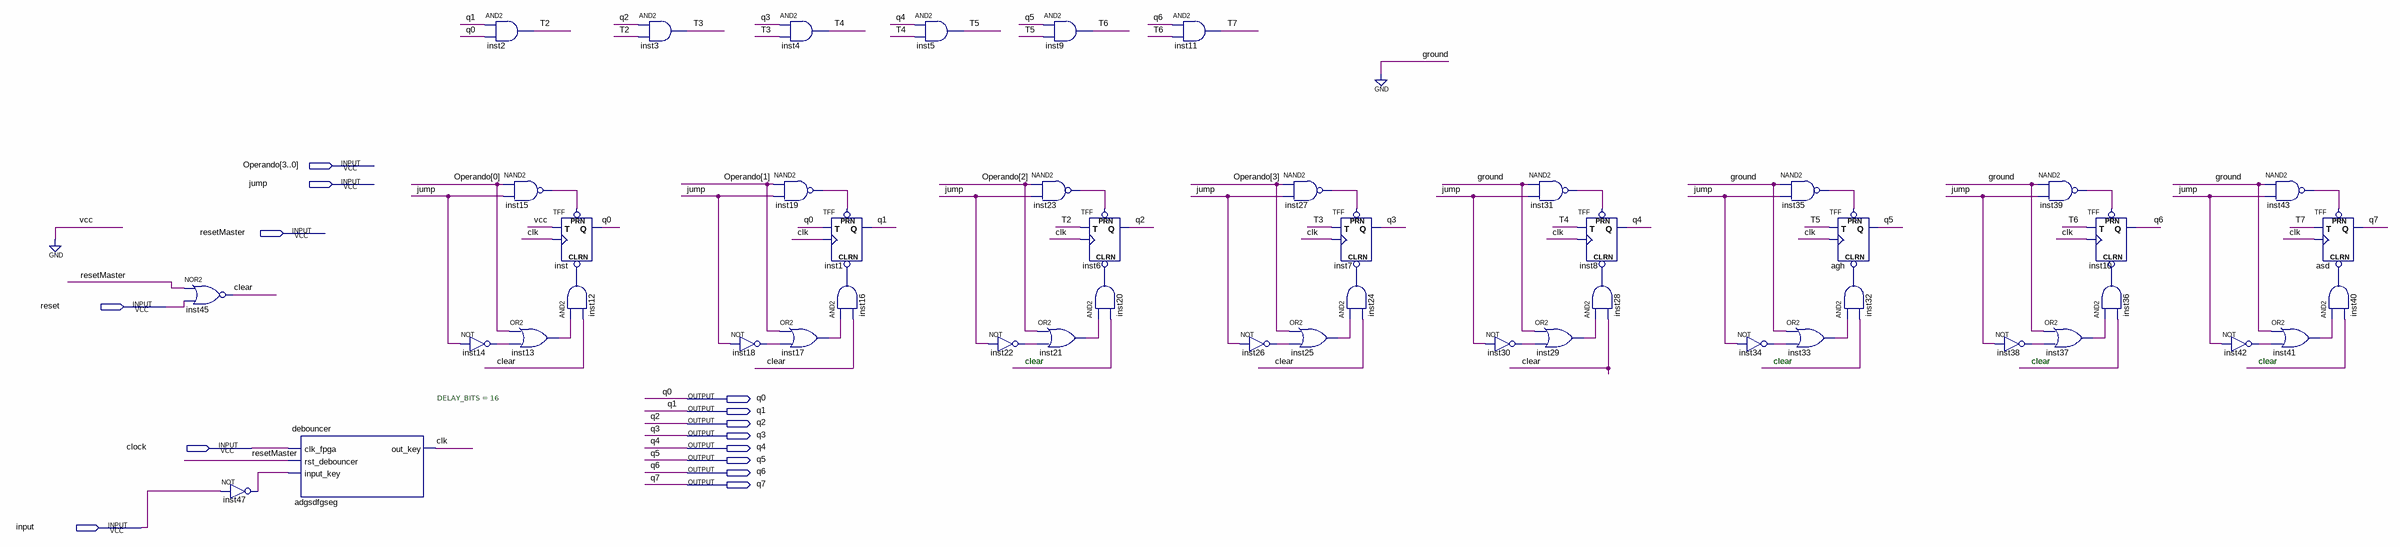
[diagram p0: schematic sheet]
// Quartus schematic Contador.bdf as structural Verilog: 49 symbols, 14 pins
module Contador (
  input  [3:0] Operando,
  input  jump,
  input  resetMaster,
  input  reset,
  input  clock,
  input  \input ,
  output q0,
  output q1,
  output q2,
  output q3,
  output q4,
  output q5,
  output q6,
  output q7
);

  wire clear, clk, inst12_out, inst13_out, inst14_out, inst15_out, inst16_out, inst17_out, inst18_out,
       inst19_out, inst20_out, inst21_out, inst22_out, inst23_out, inst24_out, inst25_out, inst26_out,
       inst27_out, inst28_out, inst29_out, inst30_out, inst31_out, inst32_out, inst33_out, inst34_out,
       inst35_out, inst36_out, inst37_out, inst38_out, inst39_out, inst40_out, inst41_out, inst42_out,
       inst43_out, inst47_out, T2, T3, T4, T5, T6, T7;

  nor inst45 (clear, resetMaster, reset);
  not inst47 (inst47_out, \input );
  debouncer #(.DELAY_BITS(16)) adgsdfgseg (
    .clk_fpga(clock), .rst_debouncer(resetMaster), .input_key(inst47_out), .out_key(clk));
  and inst2 (T2, q1, q0);
  not inst14 (inst14_out, jump);
  nand inst15 (inst15_out, Operando[0], jump);
  or inst13 (inst13_out, Operando[0], inst14_out);
  TFF inst (.PRN(inst15_out), .CLRN(inst12_out), .T(1'b0), .CLK(clk), .Q(q0));
  and inst12 (inst12_out, inst13_out, clear);
  and inst3 (T3, q2, T2);
  not inst18 (inst18_out, jump);
  and inst4 (T4, q3, T3);
  nand inst19 (inst19_out, Operando[1], jump);
  or inst17 (inst17_out, Operando[1], inst18_out);
  TFF inst1 (.PRN(inst19_out), .CLRN(inst16_out), .T(q0), .CLK(clk), .Q(q1));
  and inst16 (inst16_out, inst17_out, clear);
  and inst5 (T5, q4, T4);
  nand inst23 (inst23_out, Operando[2], jump);
  not inst22 (inst22_out, jump);
  and inst9 (T6, q5, T5);
  TFF inst6 (.PRN(inst23_out), .CLRN(inst20_out), .T(T2), .CLK(clk), .Q(q2));
  or inst21 (inst21_out, Operando[2], inst22_out);
  and inst20 (inst20_out, inst21_out, clear);
  and inst11 (T7, q6, T6);
  not inst26 (inst26_out, jump);
  nand inst27 (inst27_out, Operando[3], jump);
  or inst25 (inst25_out, Operando[3], inst26_out);
  TFF inst7 (.PRN(inst27_out), .CLRN(inst24_out), .T(T3), .CLK(clk), .Q(q3));
  and inst24 (inst24_out, inst25_out, clear);
  not inst30 (inst30_out, jump);
  nand inst31 (inst31_out, 1'b0, jump);
  or inst29 (inst29_out, 1'b0, inst30_out);
  TFF inst8 (.PRN(inst31_out), .CLRN(inst28_out), .T(T4), .CLK(clk), .Q(q4));
  and inst28 (inst28_out, inst29_out, clear);
  not inst34 (inst34_out, jump);
  nand inst35 (inst35_out, 1'b0, jump);
  or inst33 (inst33_out, 1'b0, inst34_out);
  TFF agh (.PRN(inst35_out), .CLRN(inst32_out), .T(T5), .CLK(clk), .Q(q5));
  and inst32 (inst32_out, inst33_out, clear);
  not inst38 (inst38_out, jump);
  nand inst39 (inst39_out, 1'b0, jump);
  or inst37 (inst37_out, 1'b0, inst38_out);
  TFF inst10 (.PRN(inst39_out), .CLRN(inst36_out), .T(T6), .CLK(clk), .Q(q6));
  and inst36 (inst36_out, inst37_out, clear);
  not inst42 (inst42_out, jump);
  nand inst43 (inst43_out, 1'b0, jump);
  or inst41 (inst41_out, 1'b0, inst42_out);
  TFF asd (.PRN(inst43_out), .CLRN(inst40_out), .T(T7), .CLK(clk), .Q(q7));
  and inst40 (inst40_out, inst41_out, clear);

  // Notes on the sheet:
  //   clear
  //   clear
  //   clear
  //   clear
endmodule
